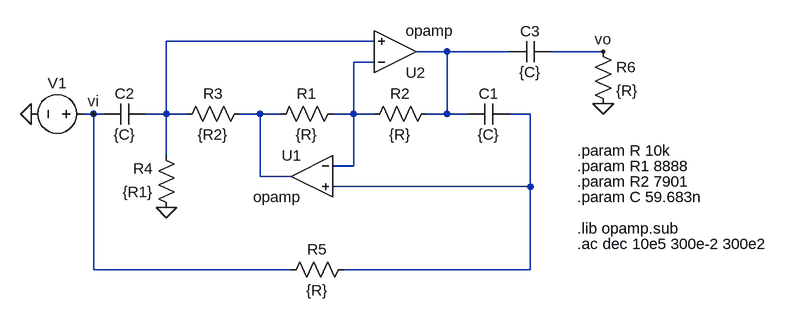
[diagram p0: schematic full.asc]
full.asc, the LTspice schematic file:
Version 4
SHEET 1 1188 680
WIRE 544 288 224 288
WIRE 656 304 608 304
WIRE 752 304 656 304
WIRE 896 304 816 304
WIRE 544 320 512 320
WIRE 112 400 96 400
WIRE 128 400 112 400
WIRE 224 400 224 288
WIRE 224 400 192 400
WIRE 256 400 224 400
WIRE 368 400 336 400
WIRE 400 400 368 400
WIRE 512 400 512 320
WIRE 512 400 480 400
WIRE 544 400 512 400
WIRE 656 400 656 304
WIRE 656 400 624 400
WIRE 688 400 656 400
WIRE 784 400 752 400
WIRE 224 464 224 400
WIRE 512 480 512 400
WIRE 512 480 480 480
WIRE 368 496 368 400
WIRE 416 496 368 496
WIRE 784 512 784 400
WIRE 784 512 480 512
WIRE 112 640 112 400
WIRE 416 640 112 640
WIRE 784 640 784 512
WIRE 784 640 496 640
FLAG 224 544 0
FLAG 16 400 0
FLAG 112 400 vi
FLAG 896 384 0
FLAG 896 304 vo
SYMBOL opamp 448 432 M0
SYMATTR InstName U1
SYMBOL opamp 576 368 M180
SYMATTR InstName U2
SYMBOL res 496 384 R90
WINDOW 0 0 56 VBottom 2
WINDOW 3 32 56 VTop 2
SYMATTR InstName R1
SYMATTR Value {R}
SYMBOL res 528 416 R270
WINDOW 0 32 56 VTop 2
WINDOW 3 0 56 VBottom 2
SYMATTR InstName R2
SYMATTR Value {R}
SYMBOL cap 752 384 R90
WINDOW 0 0 32 VBottom 2
WINDOW 3 32 32 VTop 2
SYMATTR InstName C1
SYMATTR Value {C}
SYMBOL res 352 384 R90
WINDOW 0 0 56 VBottom 2
WINDOW 3 32 56 VTop 2
SYMATTR InstName R3
SYMATTR Value {R2}
SYMBOL cap 192 384 R90
WINDOW 0 0 32 VBottom 2
WINDOW 3 32 32 VTop 2
SYMATTR InstName C2
SYMATTR Value {C}
SYMBOL res 240 560 R180
WINDOW 0 36 76 Left 2
WINDOW 3 36 40 Left 2
SYMATTR InstName R4
SYMATTR Value {R1}
SYMBOL res 400 656 R270
WINDOW 0 32 56 VTop 2
WINDOW 3 0 56 VBottom 2
SYMATTR InstName R5
SYMATTR Value {R}
SYMBOL voltage 112 400 R90
WINDOW 0 -32 56 VBottom 2
WINDOW 3 32 56 VTop 2
SYMATTR InstName V1
SYMATTR Value ""
SYMATTR Value2 AC 1
SYMBOL res 880 288 R0
SYMATTR InstName R6
SYMATTR Value {R}
SYMBOL cap 816 288 R90
WINDOW 0 0 32 VBottom 2
WINDOW 3 32 32 VTop 2
SYMATTR InstName C3
SYMATTR Value {C}
TEXT 856 456 Left 2 !.param R 10k
TEXT 856 480 Left 2 !.param R1 8888
TEXT 856 504 Left 2 !.param R2 7901
TEXT 856 528 Left 2 !.param C 59.683n
TEXT 856 576 Left 2 !.lib opamp.sub
TEXT 856 600 Left 2 !.ac dec 10e5 300e-2 300e2

The netlist it stands for:
* full.asc
XU1 N003 N005 N004 opamp Aol=100K GBW=10Meg  ; pins invin noninvin out
XU2 N003 N001 N002 opamp Aol=100K GBW=10Meg  ; pins invin noninvin out
R1 N003 N004 {R}
R2 N003 N002 {R}
C1 N005 N002 {C}
R3 N004 N001 {R2}
C2 N001 vi {C}
R4 0 N001 {R1}
R5 vi N005 {R}
V1 vi 0 AC 1
R6 vo 0 {R}
C3 vo N002 {C}
.param R 10k
.param R1 8888
.param R2 7901
.param C 59.683n
.lib opamp.sub
.ac dec 10e5 300e-2 300e2
.backanno
.end